# Altium schematic sheet RF FRONTEND.SchDoc
size A3; SheetNumber: 7; SheetTotal: 14
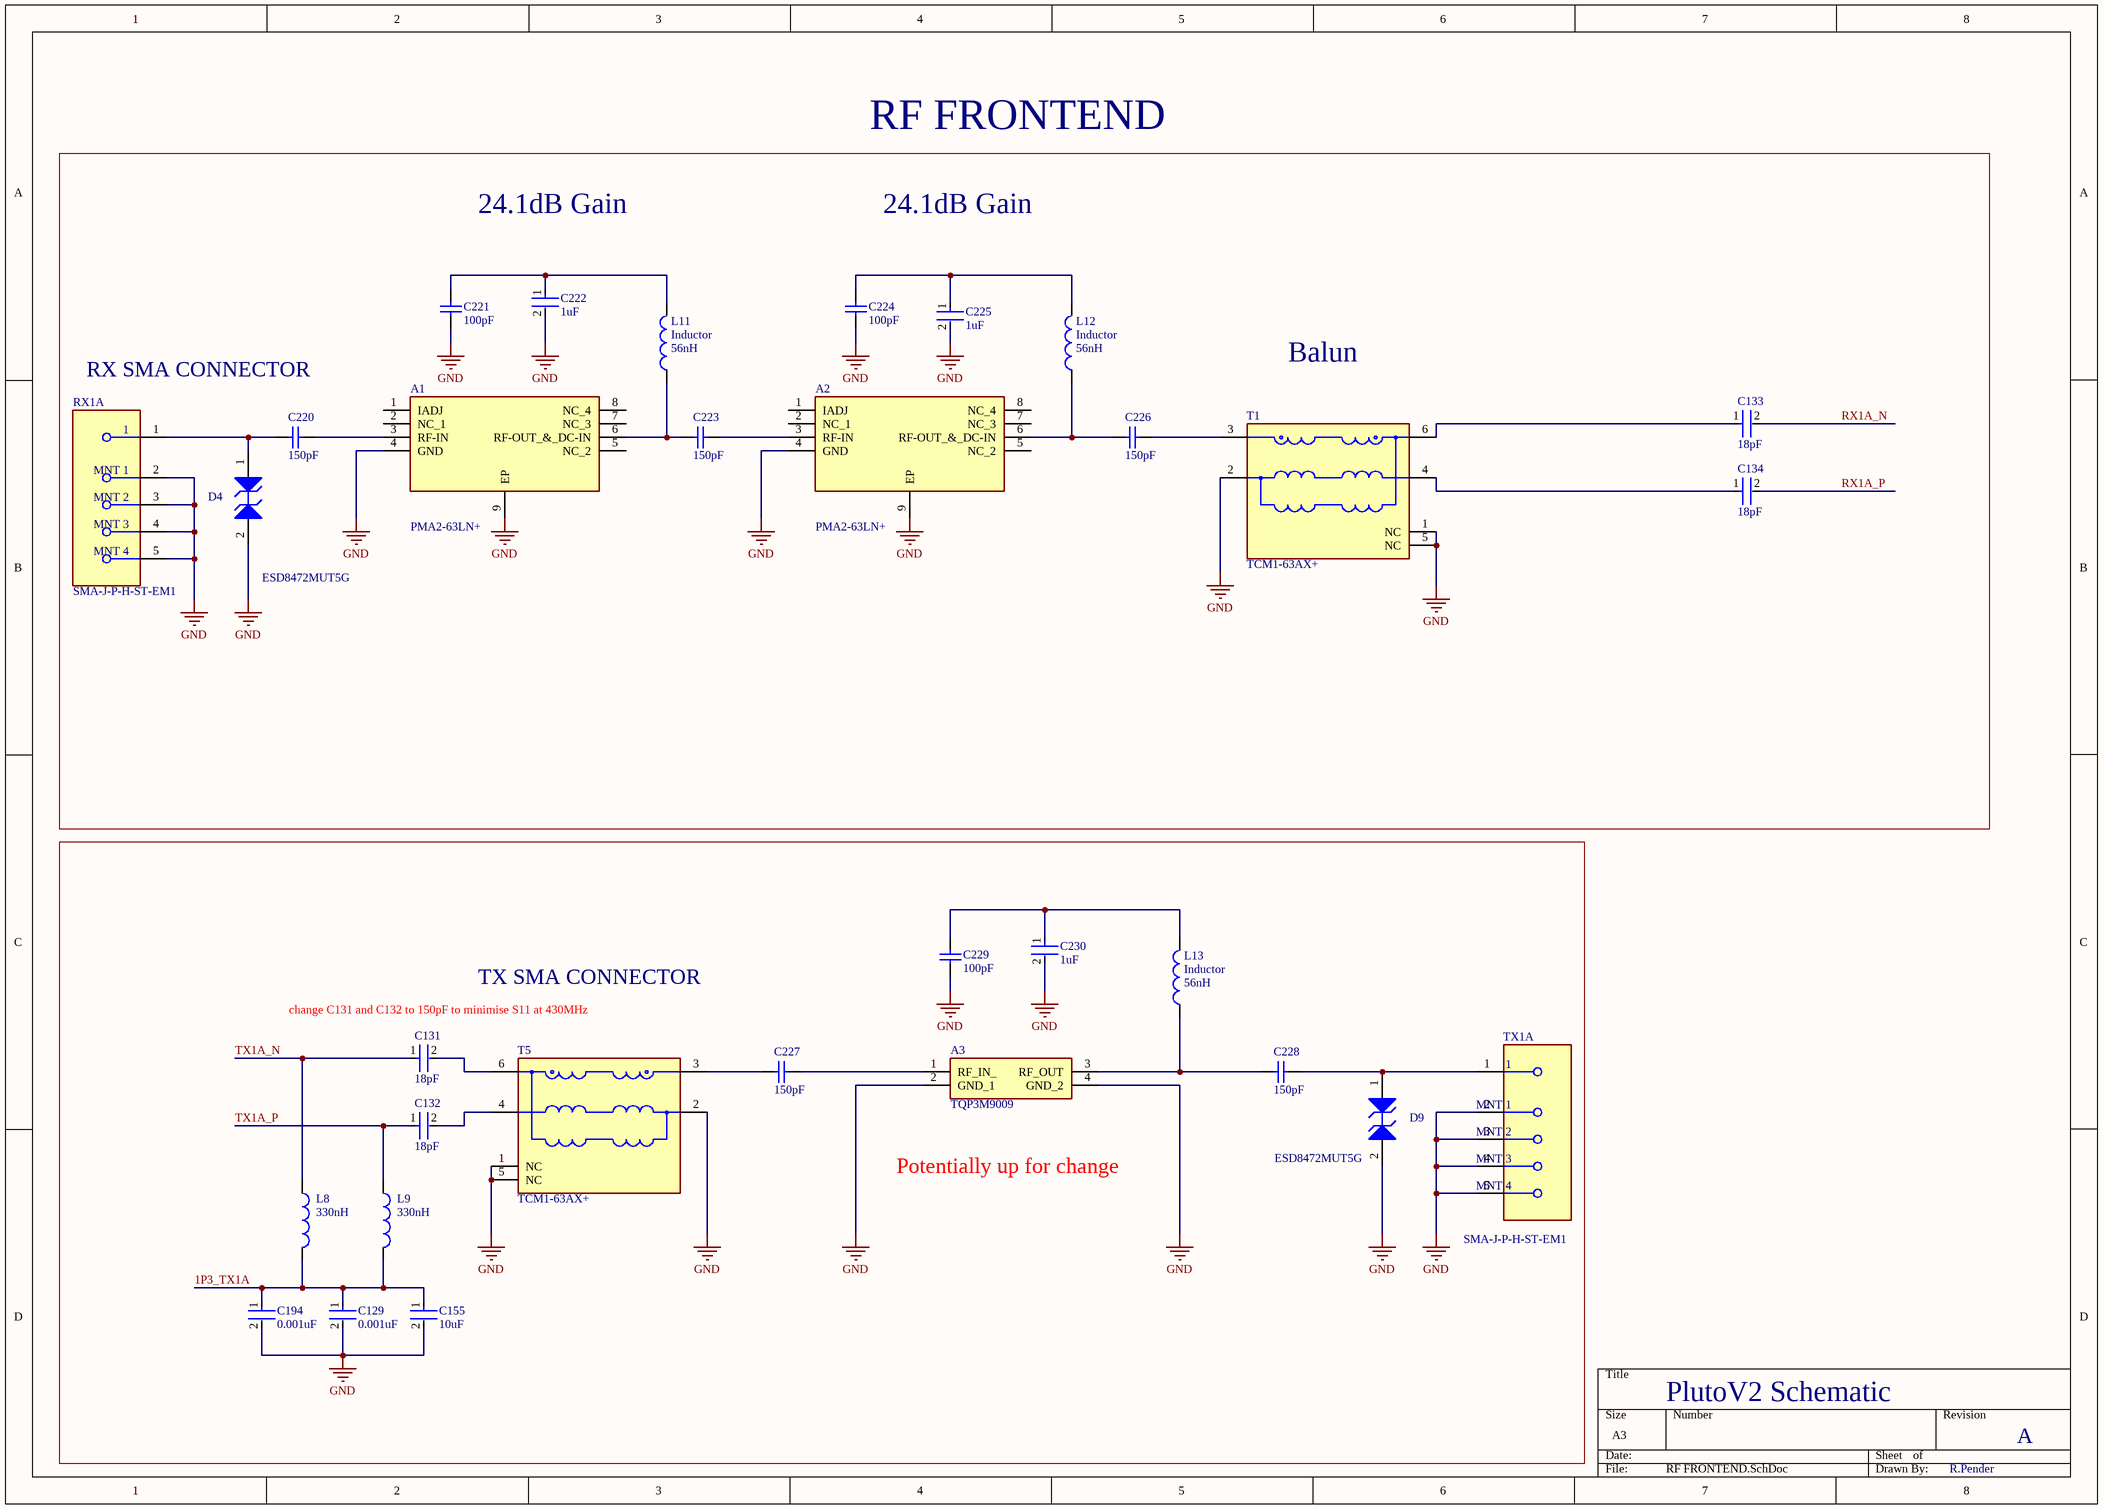
[diagram p0: RF FRONTEND.SchDoc]

## Parts
A1  PMA2-63LN+  [SON50P200X200X105-9N]
A2  PMA2-63LN+  [SON50P200X200X105-9N]
A3  TQP3M9009  [TQP3M9009]
C129  0.001uF  [FP-GRM033-0_03-MFG]
C131  18pF  [FP-GRM033-0_03-IPC_A]
C132  18pF  [FP-GRM033-0_03-IPC_A]
C133  18pF  [FP-GRM033-0_03-IPC_A]
C134  18pF  [FP-GRM033-0_03-IPC_A]
C155  10uF  [FP-GRM188-0_1-e0_2_0_55-IPC_C]
C194  0.001uF  [FP-GRM033-0_03-MFG]
C220  150pF  [CAPC1005X55X25ML05T10]
C221  100pF  [CAPC1005X55X25ML05T10]
C222  1uF  [FP-GRM155-0_05-IPC_B]
C223  150pF  [CAPC1005X55X25ML05T10]
C224  100pF  [CAPC1005X55X25ML05T10]
C225  1uF  [FP-GRM155-0_05-IPC_B]
C226  150pF  [CAPC1005X55X25LL05T10]
C227  150pF  [CAPC1005X55X25LL05T10]
C228  150pF  [CAPC1005X55X25LL05T10]
C229  100pF  [CAPC1005X55X25ML05T10]
C230  1uF  [FP-GRM155-0_05-IPC_B]
D4  ESD8472MUT5G  [ONSC-X3DFN-2-152AF-01_V]
D9  ESD8472MUT5G  [ONSC-X3DFN-2-152AF-01_V]
L8  330nH  [INDC2317X140N]
L9  330nH  [INDC2317X140N]
L11  Inductor  value 56nH  [0402-A]
L12  Inductor  value 56nH  [0402-A]
L13  Inductor  value 56nH  [0402-A]
RX1A  SMA-J-P-H-ST-EM1  [FP-SMA-J-P-H-ST-EM1-MFG]
T1  TCM1-63AX+  [FP-TCM1-63AX+-MFG]
T5  TCM1-63AX+  [FP-TCM1-63AX+-MFG]
TX1A  SMA-J-P-H-ST-EM1  [FP-SMA-J-P-H-ST-EM1-MFG]

## Blocks framed on the sheet
RF FRONTEND: A1 A2 C133 C134 C220-C226 D4 L11 L12 RX1A T1

## Nets
GND: A1.4(GND) A1.9(EP) A2.4(GND) A2.9(EP) A3.2(GND_1) A3.4(GND_2) C129.2 C155.2 C194.2 C221.2 C222.2 C224.2 C225.2 C229.2 C230.2 D4.2(A2) D9.2(A2) RX1A.2(MNT_1) RX1A.3(MNT_2) RX1A.4(MNT_3) RX1A.5(MNT_4) T1.1(NC) T1.2(GND) T1.5(NC) T5.1(NC) T5.2(GND) T5.5(NC) TX1A.2(MNT_1) TX1A.3(MNT_2) TX1A.4(MNT_3) TX1A.5(MNT_4)
1P3_TX1A: C129.1 C155.1 C194.1 L8.2 L9.2
RX1A_N: C133.2
RX1A_P: C134.2
TX1A_N: C131.1 L8.1
TX1A_P: C132.1 L9.1
NetA1_3: A1.3(RF-IN) C220.2
NetA1_6: A1.6(RF-OUT_&_DC-IN) C223.1 L11.1
NetA2_3: A2.3(RF-IN) C223.2
NetA2_6: A2.6(RF-OUT_&_DC-IN) C226.1 L12.1
NetA3_1: A3.1(RF_IN_) C227.2
NetA3_3: A3.3(RF_OUT) C228.1 L13.1
NetC131_2: C131.2 T5.6(SECONDARY_DOT)
NetC132_2: C132.2 T5.4(SECONDARY)
NetC133_1: C133.1 T1.6(SECONDARY_DOT)
NetC134_1: C134.1 T1.4(SECONDARY)
NetC220_1: C220.1 D4.1(A1) RX1A.1
NetC221_1: C221.1 C222.1 L11.2
NetC224_1: C224.1 C225.1 L12.2
NetC226_2: C226.2 T1.3(PRIMARY_DOT)
NetC227_1: C227.1 T5.3(PRIMARY_DOT)
NetC228_2: C228.2 D9.1(A1) TX1A.1
NetC229_1: C229.1 C230.1 L13.2

Not connected (* = marked no-connect by the designer): A1 1(IADJ) 2(NC_1) 5(NC_2) 7(NC_3) 8(NC_4); A2 1(IADJ) 2(NC_1) 5(NC_2) 7(NC_3) 8(NC_4)

## Notes on the sheet
- 24.1dB Gain
- RX SMA CONNECTOR
- Balun
- TX SMA CONNECTOR
- change C131 and C132 to 150pF to minimise S11 at 430MHz
- Potentially up for change
- PlutoV2 Schematic
- A
- R.Pender

## Library data of the parts
A1 A2 = PMA2-63LN+: Integrated Circuit; Manufacturer_Name: Mini-Circuits; Datasheet Link: https://www.minicircuits.com/pdfs/PMA2-63LN+.pdf; Height: 1.05mm; Manufacturer_Part_Number: PMA2-63LN+
A3 = TQP3M9009: Integrated Circuit; Manufacturer_Name: Qorvo; Datasheet Link: https://componentsearchengine.com/Datasheets/1/TQP3M9009.pdf; Height: 1.6mm; Manufacturer_Part_Number: TQP3M9009
C129 C194 = CMP-2010-01706-2: Chip Multilayer Ceramic Capacitors for General Purpose, 0201, 1000pF, X7R, 15%, 10%, 25V; Capacitance: 1nF; Max Operating Temperature: 125°C; Material: Ceramic; Lead Free: Lead Free; Radiation Hardening: No; Dielectric: X7R; Height: 0.3mm; Mount: Surface Mount; Packaging: Tape and Reel; Termination: SMD/SMT; Thickness: 0.013inch; Case Code (Metric): 0603; Tolerance: 10%; Voltage Rating (DC): 25V; REACH SVHC: No SVHC; Package Quantity: 1; Depth: 0.3mm; Voltage: 25V; Case/Package: 0201; Case Code (Imperial): 0201; Voltage Rating: 25V; Min Operating Temperature: -55°C; Length: 0.6mm; Width: 0.012inch
C131-C134 = CMP-2010-01507-2: Chip Multilayer Ceramic Capacitors for General Purpose, 0201, 18pF, C0G, 30ppm/°C, 5%, 50V; Max Operating Temperature: 125°C; Case Code (Metric): 0603; Case Code (Imperial): 0201; Capacitance: 18pF; Voltage Rating (DC): 50V; Lead Free: Lead Free; Mount: Surface Mount; Radiation Hardening: No; Height: 0.3mm; Package Quantity: 15000; Depth: 0.3mm; Tolerance: 5%; Thickness: 0.013inch; Width: 0.3mm; Packaging: Tape and Reel; Voltage Rating: 50V; Dielectric: C0G; Length: 0.6mm; Termination: SMD/SMT; Min Operating Temperature: -55°C; Case/Package: 0201; Voltage: 50V
C155 = CMP-2006-02792-2: Chip Multilayer Ceramic Capacitors for General Purpose, 0603, 10uF, X5R, 15%, 20%, 6.3V; Packaging: Tape and Reel; Voltage Rating (DC): 6.3V; Width: 0.031inch; Termination: SMD/SMT; Dielectric: X5R; Package Quantity: 4000; Voltage Rating: 6.3V; Capacitance: 10uF; Case/Package: 0603; Min Operating Temperature: -55°C; Voltage: 6.3V; Length: 1.6mm; Thickness: 0.035inch; Lead Free: Lead Free; Depth: 0.8mm; Case Code (Imperial): 0603; Max Operating Temperature: 85°C; Material: Ceramic; Height: 0.8mm; Tolerance: 20%; Mount: Surface Mount; REACH SVHC: No SVHC; Radiation Hardening: No; Case Code (Metric): 1608
C220 C223 C226-C228 = CMP-2008-04269-1: Manufacturer: Murata; Part Number: GRM1555C1H151JA01D
C221 C224 C229 = CMP-2008-03915-1: Manufacturer: Murata; Part Number: GRM1555C1H101JA01D
C222 C225 C230 = CMP-2008-04581-2: Chip Multilayer Ceramic Capacitors for General Purpose, 0402, 1.0uF, X5R, 15%, 10%, 25V; Height: 0.5mm; Voltage: 25V; Tolerance: 10%; Termination: SMD/SMT; Dielectric: X5R; REACH SVHC: No SVHC; Case Code (Imperial): 0402; Max Operating Temperature: 85°C; Lead Free: Lead Free; Case/Package: 0402; Mount: Surface Mount; Width: 0.5mm; Weight: 0.000212oz; Min Operating Temperature: -55°C; Voltage Rating (DC): 25V; Length: 1mm; Thickness: 0.022inch; Voltage Rating: 25V; Material: Ceramic; Case Code (Metric): 1005; Package Quantity: 10000; Packaging: Tape and Reel; Depth: 0.5mm; Capacitance: 1uF
D4 D9 = CMP-1063-00281-1: Ultra-Low Capacitance ESD Protection, Micro-Packaged Diode for ESD Protection, 2-Pin X3DFN, Pb-Free, Tape and Reel; Manufacturer: On Semiconductor; IR Max (uA): 0.05; C Max (pF): 0.3; V(BR) Min (V): 7; VRWM Max (V): 5.3; Number of Lines: 1; Direction: Bidirectional; PartNumber: ESD8472MUT5G; PackageVersion: Rev. O, 04/2011; RoHS: Pb-Free; PackageDescription: 2-Pin Small Outline No-Lead, Body 0.62 x 0.32 mm, Pitch 0.355 mm; ComponentLink1Description: Manufacturer URL; ComponentLink1URL: http://www.onsemi.com/; Packing: Tape and Reel; Mounting Technology: Surface Mount; PackageReference: X3DFN-2-152AF-01; ComponentLink3Description: Package Specification; ComponentLink2Description: Datasheet; ComponentLink3URL: http://www.onsemi.cn/pub_link/Collateral/152AF.PDF; DatasheetVersion: Rev. 4; ComponentLink2URL: http://www.onsemi.cn/pub_link/Collateral/ESD8472-D.PDF
L8 L9 = Inductor: Code_IEC: 1005; Value: 10mH; Published: 8-Jun-2000; LatestRevisionDate: 29-May-2009; LatestRevisionNote: IPC-7351 Footprint Added.; PackageReference: 0402-A; Publisher: Altium Limited; PackageDescription: Chip Inductor; Code_JEITA: 0402
L11-L13 = Inductor: Code_IEC: 1005; Published: 8-Jun-2000; LatestRevisionDate: 29-May-2009; LatestRevisionNote: IPC-7351 Footprint Added.; PackageReference: 0402-A; Publisher: Altium Limited; PackageDescription: Chip Inductor; Code_JEITA: 0402
RX1A TX1A = CMP-02754-000006-1: CONN SMA JACK STR 50OHM EDGE MNT; Dielectric Material: PTFE; Center Contact Plating: Gold; Max Frequency: 6GHz; Body Material: Brass; Voltage Rating: 335V; Impedance: 50R; Package Quantity: 1; Case/Package: SMA; Max Operating Temperature: 125°C; Fastening Type: Threaded; Orientation: Straight; Depth: 13.33mm; RoHS Compliant: Yes; Length: 6.35mm; Insulation Material: Polytetrafluoroethylene; Termination: Solder; Min Operating Temperature: -65°C; Housing Color: Gold; Contact Plating: Gold; Contact Material: Copper; Connector Type: SMA; Mount: Edge; Series: SMA; Packaging: Tray; Body Plating: Gold; Radiation Hardening: No
T1 T5 = CMP-199822-000001-1: 1:1 CORE & WIRE Transformer, 10 - 6000 MHz, 50Ω; Manufacturer: Mini-Circuits; Insertion Loss: 1.16-1.8dB; Return Loss: 9.42-16.9dB; Lead Free: Yes; Device Class L3: unset; Temperature: -40°C to +85°C; Manufacturer Part Number: TCM1-63AX+; Frequency: 10-6000MHz; Device Class L2: Transformers; RoHS: TRUE; Octopart: https://octopart.com/tcm1-63ax%2B-mini-circuits-107315723; Temperature Range Low: -40°C; Category: Trans; Package: 0; ComponentLink2URL: https://www.minicircuits.com/pdfs/TCM1-63AX+.pdf; ComponentLink2Description: Datasheet; Automotive: No; Height: 4.06mm; Device Class L1: Passive Components; Temperature Range High: +85°C; Turns Ratio: 1:1